# Altium schematic sheet LPDDR4X_Channel_A.SchDoc
size A4; SheetNumber: 14; SheetTotal: 36
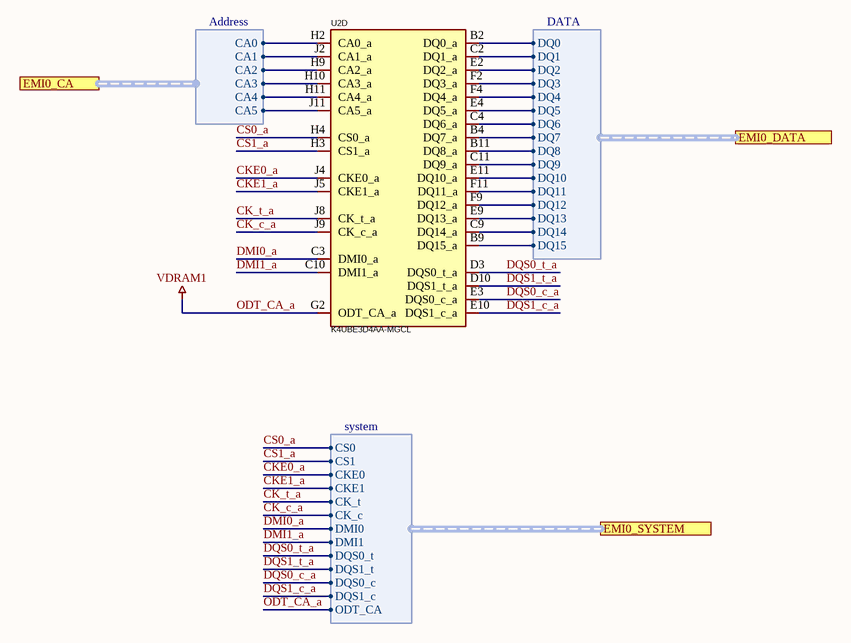
[diagram p0: LPDDR4X_Channel_A.SchDoc]

## Parts
U2  K4UBE3D4AA-MGCL  [K4F8E304HB-MGCJ]  (part D of 5)

## Ports
EMI0_CA (harness Address, see LPDDR4X[6000,9400], LPDDR4X[7000,9400], MT8365[2420,6400], MT8365_DDR4X[7500,5500]), EMI0_DATA (harness DATA, see LPDDR4X[6000,9820], LPDDR4X[7000,9820], MT8365[2294.4,6800], MT8365_DDR4X[7800,9200]), EMI0_SYSTEM (harness system, see LPDDR4X[6000,8860], LPDDR4X[7000,8860], MT8365[2200,5960], MT8365_DDR4X[8200,3000])

## Harnesses
DATA: DQ0, DQ1, DQ2, DQ3, DQ4, DQ5, DQ6, DQ7, DQ8, DQ9, DQ10, DQ11, DQ12, DQ13, DQ14, DQ15
Address: CA0, CA1, CA2, CA3, CA4, CA5
system: CS0, CS1, CKE0, CKE1, CK_t, CK_c, DMI0, DMI1, DQS0_t, DQS1_t, DQS0_c, DQS1_c, ODT_CA

## Nets
ODT_CA_a: U2.G2(ODT_CA_a) ; port EMI0_SYSTEM.ODT_CA  [also labelled VDRAM1]
CK_c_a: U2.J9(CK_c_a) ; port EMI0_SYSTEM.CK_c
CK_t_a: U2.J8(CK_t_a) ; port EMI0_SYSTEM.CK_t
CKE0_a: U2.J4(CKE0_a) ; port EMI0_SYSTEM.CKE0
CKE1_a: U2.J5(CKE1_a) ; port EMI0_SYSTEM.CKE1
CS0_a: U2.H4(CS0_a) ; port EMI0_SYSTEM.CS0
CS1_a: U2.H3(CS1_a) ; port EMI0_SYSTEM.CS1
DMI0_a: U2.C3(DMI0_a) ; port EMI0_SYSTEM.DMI0
DMI1_a: U2.C10(DMI1_a) ; port EMI0_SYSTEM.DMI1
DQS0_c_a: U2.E3(DQS0_c_a) ; port EMI0_SYSTEM.DQS0_c
DQS0_t_a: U2.D3(DQS0_t_a) ; port EMI0_SYSTEM.DQS0_t
DQS1_c_a: U2.E10(DQS1_c_a) ; port EMI0_SYSTEM.DQS1_c
DQS1_t_a: U2.D10(DQS1_t_a) ; port EMI0_SYSTEM.DQS1_t
NetU2_B2: U2.B2(DQ0_a) ; port EMI0_DATA.DQ0
NetU2_B4: U2.B4(DQ7_a) ; port EMI0_DATA.DQ7
NetU2_B9: U2.B9(DQ15_a) ; port EMI0_DATA.DQ15
NetU2_B11: U2.B11(DQ8_a) ; port EMI0_DATA.DQ8
NetU2_C2: U2.C2(DQ1_a) ; port EMI0_DATA.DQ1
NetU2_C4: U2.C4(DQ6_a) ; port EMI0_DATA.DQ6
NetU2_C9: U2.C9(DQ14_a) ; port EMI0_DATA.DQ14
NetU2_C11: U2.C11(DQ9_a) ; port EMI0_DATA.DQ9
NetU2_E2: U2.E2(DQ2_a) ; port EMI0_DATA.DQ2
NetU2_E4: U2.E4(DQ5_a) ; port EMI0_DATA.DQ5
NetU2_E9: U2.E9(DQ13_a) ; port EMI0_DATA.DQ13
NetU2_E11: U2.E11(DQ10_a) ; port EMI0_DATA.DQ10
NetU2_F2: U2.F2(DQ3_a) ; port EMI0_DATA.DQ3
NetU2_F4: U2.F4(DQ4_a) ; port EMI0_DATA.DQ4
NetU2_F9: U2.F9(DQ12_a) ; port EMI0_DATA.DQ12
NetU2_F11: U2.F11(DQ11_a) ; port EMI0_DATA.DQ11
NetU2_H2: U2.H2(CA0_a) ; port EMI0_CA.CA0
NetU2_H9: U2.H9(CA2_a) ; port EMI0_CA.CA2
NetU2_H10: U2.H10(CA3_a) ; port EMI0_CA.CA3
NetU2_H11: U2.H11(CA4_a) ; port EMI0_CA.CA4
NetU2_J2: U2.J2(CA1_a) ; port EMI0_CA.CA1
NetU2_J11: U2.J11(CA5_a) ; port EMI0_CA.CA5

## Library data of the parts
U2 = K4UBE3D4AA-MGCL: Integrated Circuit; Manufacturer: SAMSUNG(三星半导体); Add into BOM: yes; Memory Format: SDRAM LPDDR4X; Clock Frequency (fc): 2133MHz; Memory Size: 32Gbit; Supply Voltage: 1.7V~1.95V; Symbol: K4UBE3D4AA-MGCL; Device: K4UBE3D4AA-MGCL; LCSC Part Name: K4UBE3D4AA-MGCL 停产; Supplier Part: C2920257; Manufacturer Part: K4UBE3D4AA-MGCL; Supplier Footprint: FBGA-200; JLCPCB Part Class: Extended Part; Datasheet: https://atta.szlcsc.com/upload/public/pdf/source/20231024/5530CB18C2033A14DEC9B3A35E728586.pdf; Supplier: LCSC; Convert to PCB: yes; Supply current: -; Refresh Current: -; Operating Temperature: -25℃~+85℃